# EAGLE board E-bookReader (EAGLE 9.7.0)
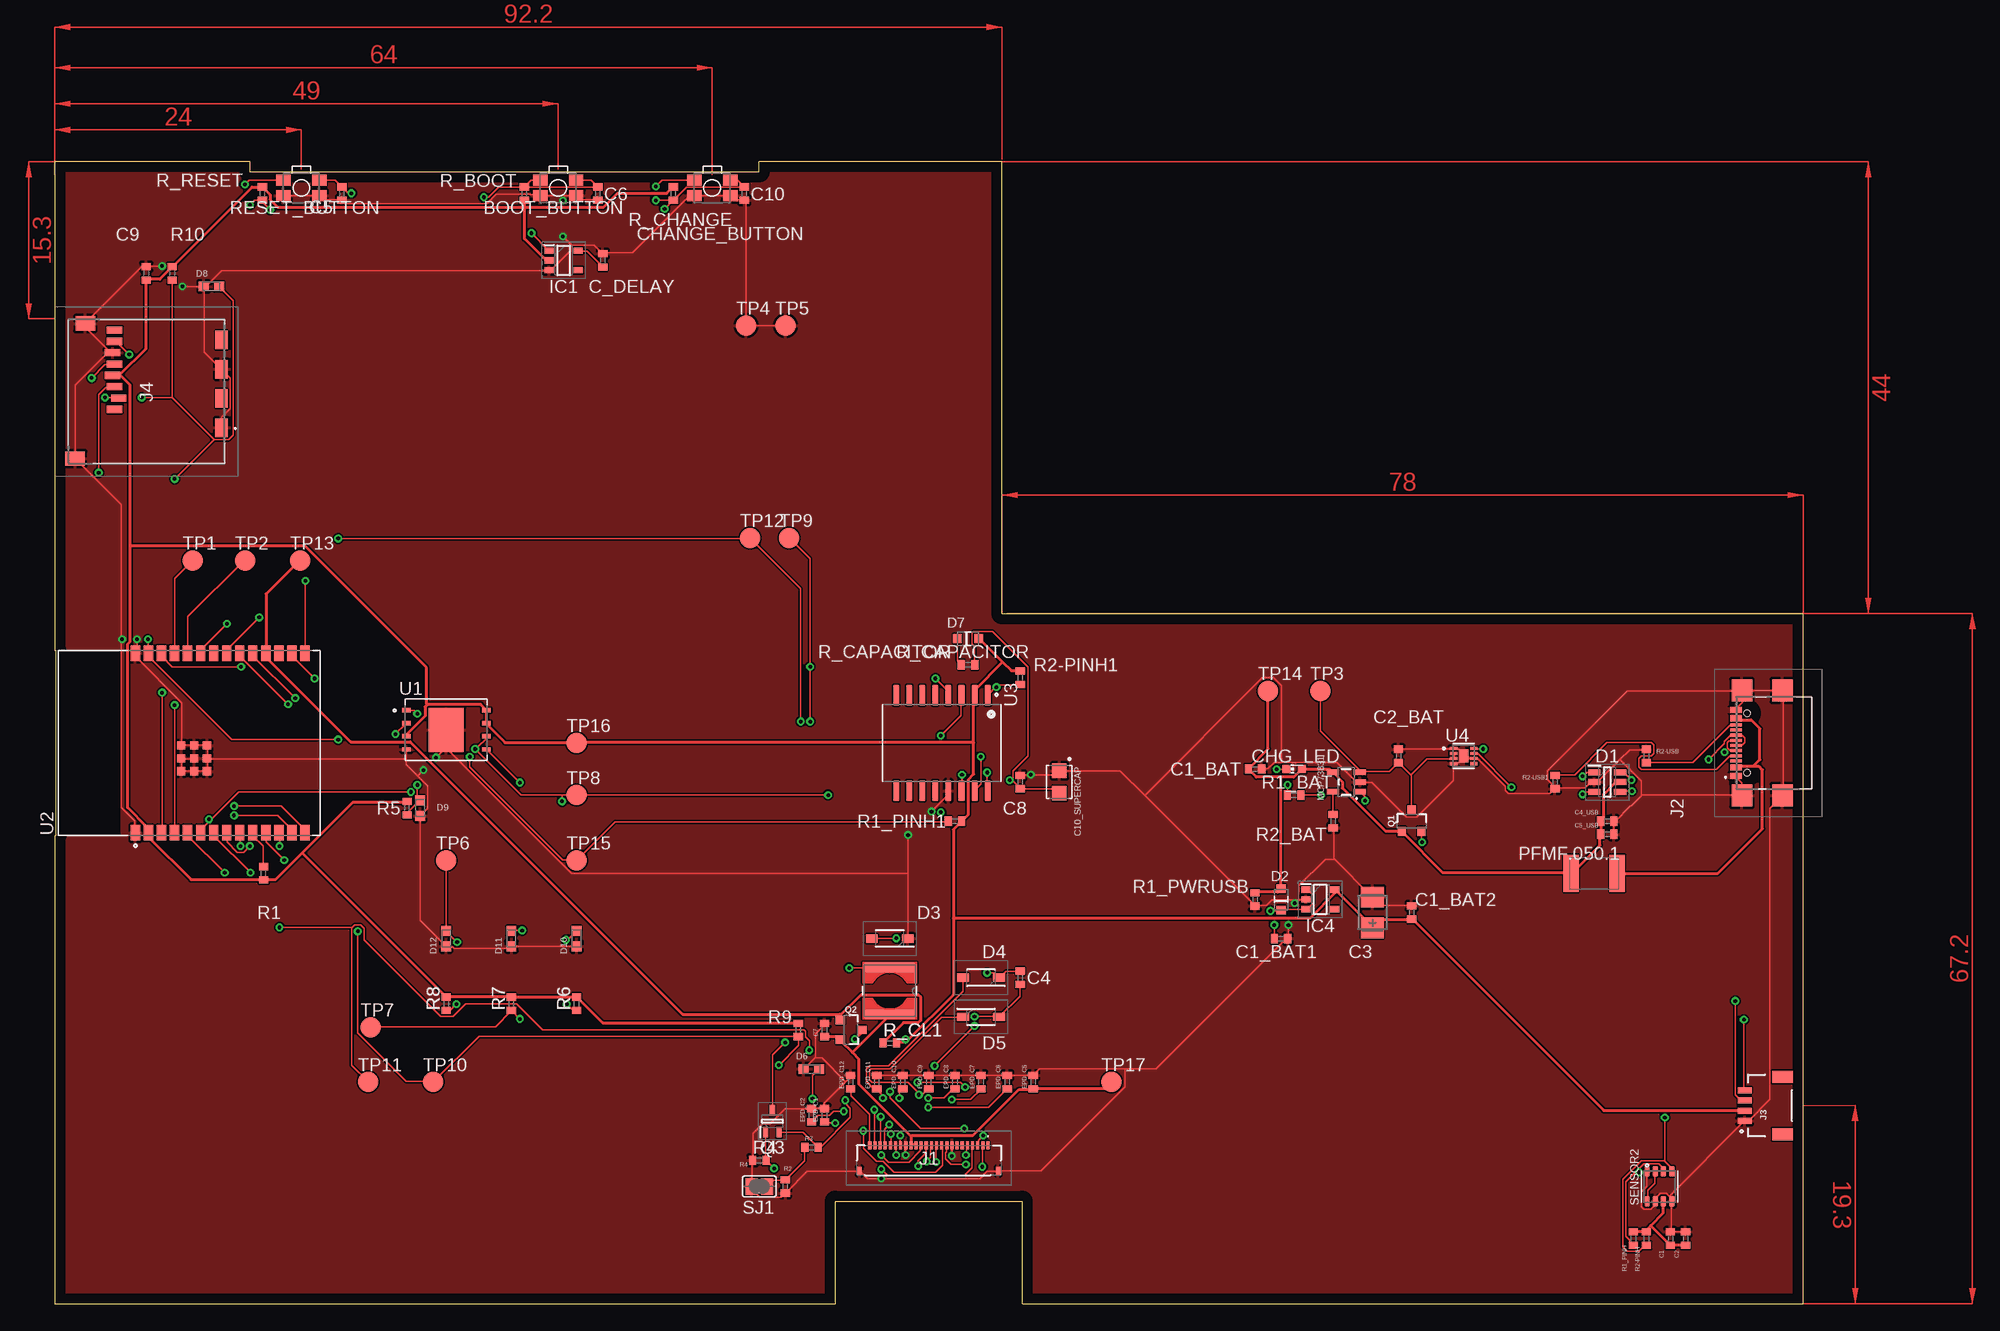
[diagram p1: board, top side]
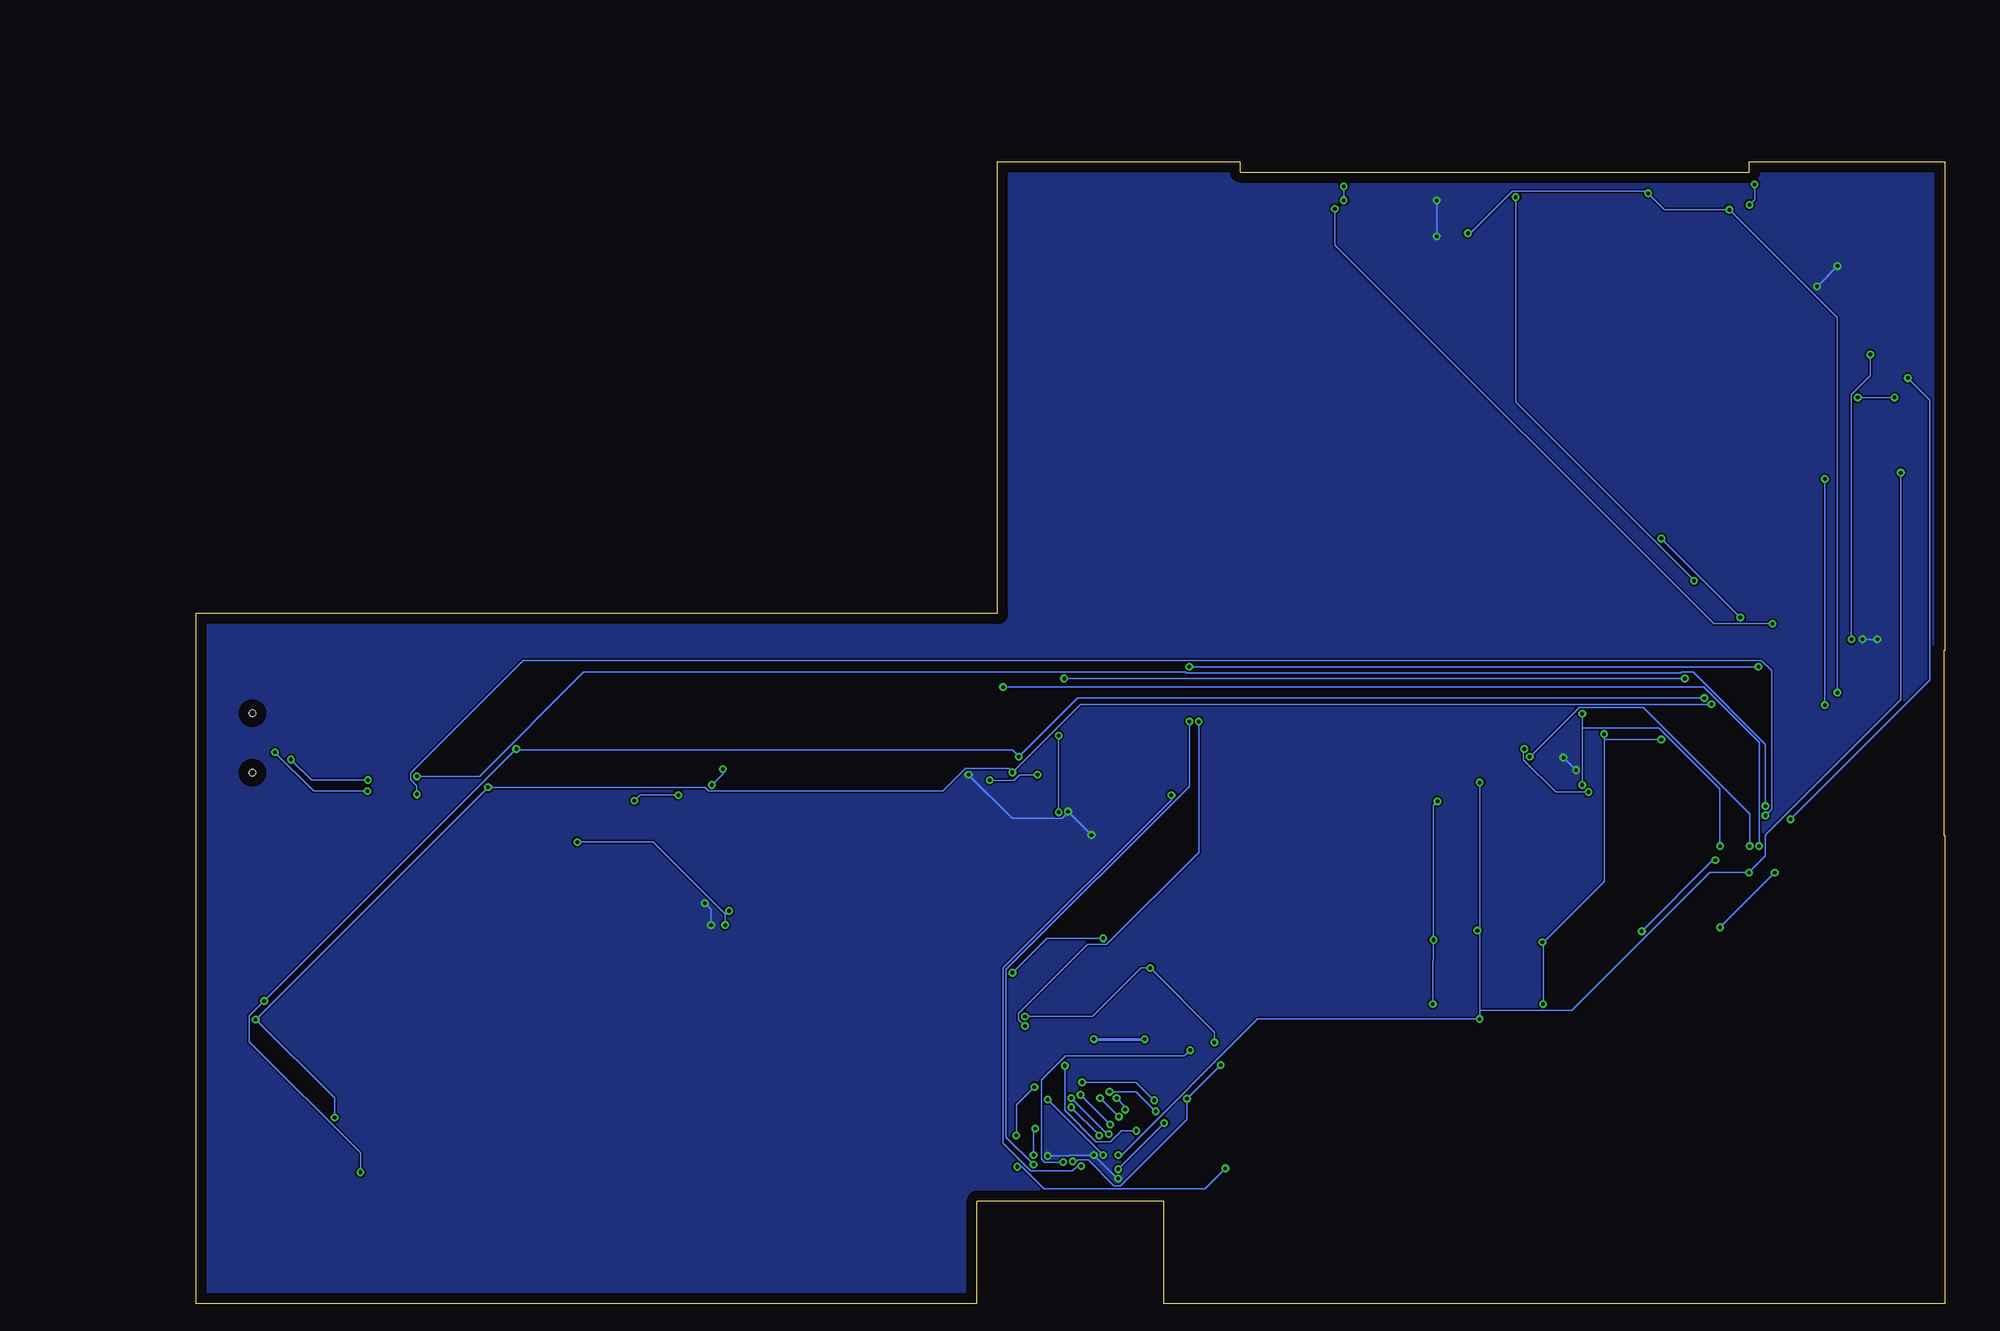
[diagram p2: board, bottom side, seen from below]

Size 170.2 x 111.2 mm. Coordinates in mm from the lower left corner, seen from the top.
Outline: 0,0 76,0 76,10 94.2,10 94.2,0 170.2,0 170.2,67.2 92.2,67.2 92.2,111.2 68.57,111.2 68.57,110.2 19,110.2 19,111.2 0,111.2 0,63.6 0.1,63.6 0.1,45.6 0,45.6 0,0
Copper layers (1*16): Top 0.035mm / dielectric 1.5mm / Bottom 0.035mm
Design rules "Fusion Electronics Design Rules": minimum track width 6mil, minimum drill 0.35mm, track to track 6mil, track to pad 6mil, pad to pad 6mil, via to via 6mil, smd to smd 6mil, copper to edge 40mil, drill to drill 6mil, minimum pad ring 10mil, minimum via ring 8mil, stop-mask expansion 4mil, vias tented up to drill 0mil, thermal gap 10mil
Net classes: 1 power: width 0.3 mm

## Footprints (pad centres in the part's own frame; a part is rotated, then mirrored left to right if it is on the bottom)
MYBUTTON = smd 1.4 x 1.05: 1 1.75,0.75; 2 -1.75,0.75; 3 -1.75,-0.75; 4 1.75,-0.75
EAGLE-LTSPICE_C0402 = smd 0.7 x 0.9: 1 -0.65,0; 2 0.65,0
RCL_CT3528 = smd 2 x 2.2: + -1.5,0; - 1.5,0
CAPCP3225X100N = smd 1.4 x 1.4: 1 -1.1,0; 2 1.1,0
ADAFRUIT_CHIP-LED0603 = smd 0.8 x 0.8: A 0,-0.75; C 0,0.75
SOT95P280X145-6N = smd 1.2 x 0.6: 1 -1.25,0.95; 2 -1.25,0; 3 -1.25,-0.95; 4 1.25,-0.95; 5 1.25,0; 6 1.25,0.95
ESP32_WROVER_AVX---SD0805S020S1R0_AVX_SD0805S020S1R0_0 = smd 0.8 x 0.9: 1 -1.05,0; 2 1.05,0
SOD3716X135N = smd 1.15 x 0.8: 1 -1.75,0; 2 1.75,0
DIOC1608X36N = smd 0.97 x 0.94: 1 -0.75,0; 2 0.75,0
SOT95P280X125-5N = smd 0.9 x 0.6: 1 -1.4,0.95; 2 -1.4,0; 3 -1.4,-0.95; 4 1.4,-0.95; 5 1.4,0.95
SOT95P280X120-5N = smd 0.9 x 0.6: 1 -1.4,0.95; 2 -1.4,0; 3 -1.4,-0.95; 4 1.4,-0.95; 5 1.4,0.95
FH34SRJ24S05SH99 = smd 0.3 x 0.8: 1 5.75,1.45; 2 5.25,1.45; 3 4.75,1.45; 4 4.25,1.45; 5 3.75,1.45; 6 3.25,1.45; 7 2.75,1.45; 8 2.25,1.45; 9 1.75,1.45; 10 1.25,1.45; 11 0.75,1.45; 12 0.25,1.45; 13 -0.25,1.45; 14 -0.75,1.45; 15 -1.25,1.45; 16 -1.75,1.45; 17 -2.25,1.45; 18 -2.75,1.45; 19 -3.25,1.45; 20 -3.75,1.45; 21 -4.25,1.45; 22 -4.75,1.45; 23 -5.25,1.45; 24 -5.75,1.45 | smd 0.4 x 0.8: MP1 6.75,-1.05; MP2 -6.75,-1.05
SAMACSYS_PARTS_USB4110GFA = smd 0.3 x 1.15: A1 -3.35,3.678; A4 -2.55,3.678; A5 -1.25,3.678; A6 -0.25,3.678; A7 0.25,3.678; A8 1.25,3.678; A9 2.55,3.678; A12 3.35,3.678; B1 3.05,3.678; B4 2.25,3.678; B5 1.75,3.678; B6 0.75,3.678; B7 -0.75,3.678; B8 -1.75,3.678; B9 -2.25,3.678; B12 -3.05,3.678 | smd 2.18 x 2: MP1 -5.11,-0.827; MP2 5.11,-0.827; MP3 -5.11,3.103; MP4 5.11,3.103 | hole 0.65: -2.89,2.603; 2.89,2.603
JST04_1MM_RA = smd 0.6 x 1.35: 1 -1.5,0; 2 -0.5,0; 3 0.5,0; 4 1.5,0 | smd 1.2 x 2: NC1 2.8,-3.675; NC2 -2.8,-3.675
112ATAARR03ATTEND = smd 1.8 x 1.2: G1 10.6,10.4; G2 4.9,10.4; S1 7.75,10.4; S2 2.05,10.4 | smd 1.4 x 1.9: G3 13.6,-3.85; G4 0.45,-2.85 | smd 0.7 x 1.5: P1 8.8,0; P2 7.7,0.4; P3 6.6,0; P4 5.5,-0.2; P5 4.4,0; P6 3.3,-0.2; P7 2.2,0; P8 1.1,0
IND_4828-WE-TPC_WRE = smd 0.889 x 4.826: 1 -2.286,0; 2 2.286,0
ESP32_WROVER_SPARKFUN-IC-POWER_SOT23-5 = smd 0.55 x 1.2: 1 -0.95,-1.3; 2 0,-1.3; 3 0.95,-1.3; 4 0.95,1.3; 5 -0.95,1.3
ESP32C6_VARISTOR_CT/CN1812 = smd 1.5 x 3.6: 1 -2.25,0; 2 2.25,0
ESP32_WROVER_SPARKFUN-DISCRETESEMI_SOT23-3 = smd 0.8 x 0.9: 1 -0.95,-1; 2 0.95,-1; 3 0,1.1
SOT65P210X110-3N = smd 1.05 x 0.5: 1 -1.05,0.65; 2 -1.05,-0.65; 3 1.05,0
ESP32_WROVER_EAGLE-LTSPICE_R0402 = smd 0.7 x 0.9: 1 -0.65,0; 2 0.65,0
ESP32_WROVER_BME680_PSON80P300X300X100-8N = smd 1.016 x 0.5: 1 1.458,1.2; 2 1.458,0.4; 3 1.458,-0.4; 4 1.458,-1.2; 5 -1.458,-1.22; 6 -1.458,-0.4; 7 -1.458,0.4; 8 -1.458,1.2
SJ = smd 1.168 x 1.6: 1 -0.762,0; 2 0.762,0
TP20R = smd 2 x 2: TP 0,0
SON127P600X800X80-9N = smd 0.94 x 0.44: 1 -3.895,1.905; 2 -3.895,0.635; 3 -3.895,-0.635; 4 -3.895,-1.905; 5 3.895,-1.905; 6 3.895,-0.635; 7 3.895,0.635; 8 3.895,1.905 | smd 3.4 x 4.3: 9 0,0
XCVR_ESP32-C6-WROOM-1-N8 = smd 1.5 x 0.9: 1 -8.75,5.26; 2 -8.75,3.99; 3 -8.75,2.72; 4 -8.75,1.45; 5 -8.75,0.18; 6 -8.75,-1.09; 7 -8.75,-2.36; 8 -8.75,-3.63; 9 -8.75,-4.9; 10 -8.75,-6.17; 11 -8.75,-7.44; 12 -8.75,-8.71; 13 -8.75,-9.98; 14 -8.75,-11.25; 15 8.75,-11.25; 16 8.75,-9.98; 17 8.75,-8.71; 18 8.75,-7.44; 19 8.75,-6.17; 20 8.75,-4.9; 21 8.75,-3.63; 22 8.75,-2.36; 23 8.75,-1.09; 24 8.75,0.18; 25 8.75,1.45; 26 8.75,2.72; 27 8.75,3.99; 28 8.75,5.26 | smd 0.8 x 0.8: 29_1 -2.755,0.79; 29_2 -1.505,0.79; 29_3 -0.255,0.79; 29_4 -2.755,-0.46; 29_5 -1.505,-0.46; 29_6 -0.255,-0.46; 29_7 -2.755,-1.71; 29_8 -1.505,-1.71; 29_9 -0.255,-1.71
SOIC127P1032X265-16N = smd 2.05 x 0.59: 1 -4.655,4.445; 2 -4.655,3.175; 3 -4.655,1.905; 4 -4.655,0.635; 5 -4.655,-0.635; 6 -4.655,-1.905; 7 -4.655,-3.175; 8 -4.655,-4.445; 9 4.655,-4.445; 10 4.655,-3.175; 11 4.655,-1.905; 12 4.655,-0.635; 13 4.655,0.635; 14 4.655,1.905; 15 4.655,3.175; 16 4.655,4.445
SON50P200X200X80-9N = smd 0.76 x 0.27: 1 -0.985,0.75; 2 -0.985,0.25; 3 -0.985,-0.25; 4 -0.985,-0.75; 5 0.985,-0.75; 6 0.985,-0.25; 7 0.985,0.25; 8 0.985,0.75 | smd 0.9 x 1.3: 9 0,0

## Placement (x,y rotation side)
BOOT_BUTTON  BUTTON_CUSYOMV1  [MYBUTTON]  49,108.65 180 top
C1  100nF  [EAGLE-LTSPICE_C0402]  157.28,6.35 90 top
C1_BAT  4.7uF  [EAGLE-LTSPICE_C0402]  116.84,52.07 0 top
C1_BAT1  4.7uF  [EAGLE-LTSPICE_C0402]  119.38,35.56 0 top
C1_BAT2  4.7uF  [EAGLE-LTSPICE_C0402]  132.08,38.1 90 top
C2  100nF  [EAGLE-LTSPICE_C0402]  158.75,6.35 90 top
C2_BAT  4.7uF  [EAGLE-LTSPICE_C0402]  130.81,53.34 90 top
C3  100uF TANT  [RCL_CT3528]  128.27,38.1 90 top
C4  4.7uF/25V  [EAGLE-LTSPICE_C0402]  93.98,31.75 270 top
C4_USB  100nF  [EAGLE-LTSPICE_C0402]  151.13,46.99 0 top
C5  1uF  [EAGLE-LTSPICE_C0402]  27.94,108.1 270 top
C5_USB  4.7 uF  [EAGLE-LTSPICE_C0402]  151.13,45.72 0 top
C6  100nF  [EAGLE-LTSPICE_C0402]  52.85,108.1 270 top
C7  10uF  [EAGLE-LTSPICE_C0402]  74.93,26.67 90 top
C8  100nF  [EAGLE-LTSPICE_C0402]  93.98,50.8 90 top
C9  100nF  [EAGLE-LTSPICE_C0402]  8.89,100.33 90 top
C10  100nF  [EAGLE-LTSPICE_C0402]  67.12,108.1 270 top
C10_SUPERCAP  CPH3225A  [CAPCP3225X100N]  97.79,50.8 270 top
C_DELAY  100nF  [EAGLE-LTSPICE_C0402]  53.34,101.6 90 top
CHANGE_BUTTON  BUTTON_CUSYOMV1  [MYBUTTON]  64,108.65 180 top
CHG_LED  [ADAFRUIT_CHIP-LED0603]  120.65,52.07 90 top
D1  USBLC6-2SC6Y  [SOT95P280X145-6N]  151.13,50.8 0 top
D2  ESP32_WROVER_AVX---SD0805S020S1R0_AVX_SD0805S020S1R0_0_0AVX_SD0805S020S1R0_0_0  [ESP32_WROVER_AVX---SD0805S020S1R0_AVX_SD0805S020S1R0_0]  119.38,39.37 90 top
D3  MBR0530  [SOD3716X135N]  81.28,35.56 180 top
D4  MBR0530  [SOD3716X135N]  90.17,31.75 180 top
D5  MBR0530  [SOD3716X135N]  90.17,27.94 0 top
D6  PGB1010603MR  [DIOC1608X36N]  73.66,22.86 0 top
D7  ESP32_WROVER_AVX---SD0805S020S1R0_AVX_SD0805S020S1R0_0_0AVX_SD0805S020S1R0_0_0  [ESP32_WROVER_AVX---SD0805S020S1R0_AVX_SD0805S020S1R0_0]  88.9,64.77 0 top
D8  PGB1010603MR  [DIOC1608X36N]  15.24,99.06 0 top
D9  PGB1010603MR  [DIOC1608X36N]  35.56,48.26 90 top
D10  PGB1010603MR  [DIOC1608X36N]  50.8,35.56 90 top
D11  PGB1010603MR  [DIOC1608X36N]  44.45,35.56 90 top
D12  PGB1010603MR  [DIOC1608X36N]  38.1,35.56 90 top
EPD_C1  1uF/50V  [EAGLE-LTSPICE_C0402]  74.93,18.37 90 top
EPD_C2  1uF/50V  [EAGLE-LTSPICE_C0402]  73.66,18.37 90 top
EPD_C5  0.1uF/50V  [EAGLE-LTSPICE_C0402]  95.25,21.59 90 top
EPD_C6  1uF/50V  [EAGLE-LTSPICE_C0402]  92.71,21.59 90 top
EPD_C7  1uF/50V  [EAGLE-LTSPICE_C0402]  90.17,21.59 90 top
EPD_C8  1uF/50V  [EAGLE-LTSPICE_C0402]  87.63,21.59 90 top
EPD_C9  1uF/50V  [EAGLE-LTSPICE_C0402]  85.09,21.59 90 top
EPD_C10  1uF/50V  [EAGLE-LTSPICE_C0402]  82.55,21.59 90 top
EPD_C11  1uF/50V  [EAGLE-LTSPICE_C0402]  80.01,21.59 90 top
EPD_C12  1uF/50V  [EAGLE-LTSPICE_C0402]  77.47,21.59 90 top
IC1  BD5229G-TR  [SOT95P280X125-5N]  49.53,101.6 0 top
IC4  XC6220A331MR-G  [SOT95P280X120-5N]  123.19,39.37 0 top
J1  FH34SRJ-24S-0.5SH_99_  [FH34SRJ24S05SH99]  85.09,13.97 0 top
J2  SAMACSYS_PARTS_USB4110-GF-A  [SAMACSYS_PARTS_USB4110GFA]  167.36,54.61 90 top
J3  QWIIC_RIGHT_ANGLE  [JST04_1MM_RA]  164.51,19.3 90 top
J4  112A-TAAR-R03_ATTEND  [112ATAARR03ATTEND]  5.82,95.9 270 top
L1  744043680IND_4828-WE-TPC_WRE  [IND_4828-WE-TPC_WRE]  81.28,30.48 270 top
MCP73831  ESP32_WROVER_SPARKFUN-IC-POWER_MCP73831  [ESP32_WROVER_SPARKFUN-IC-POWER_SOT23-5]  125.73,50.8 90 top
PFMF.050.1  ESP32C6_VARISTORCN1812  [ESP32C6_VARISTOR_CT/CN1812]  149.86,41.91 180 top
Q1  20V/4.2A/52mΩ/1.4W  [ESP32_WROVER_SPARKFUN-DISCRETESEMI_SOT23-3]  132.08,46.99 0 top
Q2  20V/4.2A/52mΩ/1.4W  [ESP32_WROVER_SPARKFUN-DISCRETESEMI_SOT23-3]  77.47,26.67 270 top
Q3  SI1308EDL-T1-GE3  [SOT65P210X110-3N]  69.85,17.78 90 top
R1  10k  [ESP32_WROVER_EAGLE-LTSPICE_R0402]  20.32,41.91 270 top
R1_BAT  200  [ESP32_WROVER_EAGLE-LTSPICE_R0402]  120.65,49.53 0 top
R1_PINH  [ESP32_WROVER_EAGLE-LTSPICE_R0402]  153.67,6.35 90 top
R1_PINH1  10k  [ESP32_WROVER_EAGLE-LTSPICE_R0402]  87.63,46.99 0 top
R1_PWRUSB  100k  [ESP32_WROVER_EAGLE-LTSPICE_R0402]  116.84,39.37 90 top
R2  2.2  [ESP32_WROVER_EAGLE-LTSPICE_R0402]  71.12,11.43 90 top
R2-PINH  [ESP32_WROVER_EAGLE-LTSPICE_R0402]  154.94,6.35 90 top
R2-PINH1  10k  [ESP32_WROVER_EAGLE-LTSPICE_R0402]  93.98,60.96 90 top
R2-USB  5k1  [ESP32_WROVER_EAGLE-LTSPICE_R0402]  154.94,53.34 90 top
R2-USB1  5k1  [ESP32_WROVER_EAGLE-LTSPICE_R0402]  146.05,50.8 90 top
R2_BAT  2k  [ESP32_WROVER_EAGLE-LTSPICE_R0402]  124.46,46.99 90 top
R3  0.47  [ESP32_WROVER_EAGLE-LTSPICE_R0402]  73.66,15.24 0 top
R4  10K  [ESP32_WROVER_EAGLE-LTSPICE_R0402]  68.58,13.97 0 top
R5  10K  [ESP32_WROVER_EAGLE-LTSPICE_R0402]  34.29,48.26 90 top
R6  10K  [ESP32_WROVER_EAGLE-LTSPICE_R0402]  50.8,29.21 90 top
R7  10K  [ESP32_WROVER_EAGLE-LTSPICE_R0402]  44.45,29.21 90 top
R8  10K  [ESP32_WROVER_EAGLE-LTSPICE_R0402]  38.1,29.21 90 top
R9  10K  [ESP32_WROVER_EAGLE-LTSPICE_R0402]  72.39,26.67 90 top
R10  10K  [ESP32_WROVER_EAGLE-LTSPICE_R0402]  11.43,100.33 90 top
R_BOOT  10K  [ESP32_WROVER_EAGLE-LTSPICE_R0402]  45.72,108.1 270 top
R_CAPACITOR  15  [ESP32_WROVER_EAGLE-LTSPICE_R0402]  88.9,62.23 0 top
R_CHANGE  10K  [ESP32_WROVER_EAGLE-LTSPICE_R0402]  60.2,108.1 90 top
R_CL1  10K  [ESP32_WROVER_EAGLE-LTSPICE_R0402]  81.28,25.4 0 top
R_RESET  10K  [ESP32_WROVER_EAGLE-LTSPICE_R0402]  20.2,108.1 90 top
RESET_BUTTON  BUTTON_CUSYOMV1  [MYBUTTON]  24,108.65 180 top
SENSOR2  ESP32_WROVER_BME680_BME680  [ESP32_WROVER_BME680_PSON80P300X300X100-8N]  156.21,11.43 90 top
SJ1  [SJ]  68.58,11.43 0 top
TP1  TPTP20R  [TP20R]  13.43,72.39 0 top
TP2  TPTP20R  [TP20R]  18.51,72.39 0 top
TP3  TPTP20R  [TP20R]  123.19,59.69 0 top
TP4  TPTP20R  [TP20R]  67.31,95.25 0 top
TP5  TPTP20R  [TP20R]  71.12,95.25 0 top
TP6  TPTP20R  [TP20R]  38.1,43.18 0 top
TP7  TPTP20R  [TP20R]  30.73,26.92 0 top
TP8  TPTP20R  [TP20R]  50.8,49.53 0 top
TP9  TPTP20R  [TP20R]  71.5,74.58 0 top
TP10  TPTP20R  [TP20R]  36.83,21.59 0 top
TP11  TPTP20R  [TP20R]  30.48,21.59 0 top
TP12  TPTP20R  [TP20R]  67.69,74.58 0 top
TP13  TPTP20R  [TP20R]  23.88,72.39 0 top
TP14  TPTP20R  [TP20R]  118.11,59.69 0 top
TP15  TPTP20R  [TP20R]  50.8,43.18 0 top
TP16  TPTP20R  [TP20R]  50.8,54.61 0 top
TP17  TPTP20R  [TP20R]  102.87,21.59 0 top
U1  W25Q512JVEIQ  [SON127P600X800X80-9N]  38.1,55.88 0 top
U2  ESP32-C6-WROOM-1-N8  [XCVR_ESP32-C6-WROOM-1-N8]  13.1,54.61 90 top
U3  DS3231SN#  [SOIC127P1032X265-16N]  86.36,54.61 270 top
U4  MAX17048G+T10  [SON50P200X200X80-9N]  137.16,53.34 0 top

## Tracks (layer width: path | path; a pad name or v marks a point on that pad's centre or on a via)
3V3  (via drill 0.35)
  Top 0.3: 45.72,106.76 45.72,103.71 47.78,101.65 48.08,101.65 IC1.2 | 45.72,106.76 R_BOOT.2 | 45.72,106.76 53.42,106.76 54.78,108.12 59.58,108.12 R_CHANGE.2 | 6.33,90.45 5.64,90.45 J4.P4 | 6.33,90.45 8.84,92.96 8.84,99.59 C9.1 8.91,99.75 10.21,99.75 11.43,100.97 R10.2 11.51,101.04 19.2,108.74 20.19,108.74 R_RESET.2 20.27,108.66 20.95,107.97 20.95,107.52 21.72,106.76 45.72,106.76 | 24.08,43.89 21.49,41.3 20.42,41.3 R1.2 20.27,41.3 13.26,41.3 9.14,45.41 9.14,45.8 U2.2 8.99,45.95 8.99,46.41 7.09,48.31 7.09,64.24 7.32,64.47 7.32,73.76 | 24.08,43.89 29.03,48.84 34.29,48.84 R5.2 | R9.2 72.39,27.36 53.34,27.36 50.9,29.79 R6.2 50.75,29.87 44.58,29.87 R7.2 44.42,29.87 R8.2 38.02,29.95 24.08,43.89 | 6.33,90.45 7.32,89.46 7.32,73.76 | J3.2 164.44,18.82 150.8,18.82 132.21,37.41 C1_BAT2.1 132.06,37.41 129.08,37.41 128.4,36.73 C3.+ 128.32,36.65 124.66,40.31 IC4.5 124.74,40.08 122.22,37.57 87.48,37.57 | 36.27,58.37 36.04,58.14 36.04,57.23 34.21,55.4 34.21,55.24 U1.3 | 36.27,58.37 41.45,58.37 41.99,57.84 U1.8 41.99,57.68 41.99,56.54 U1.7 42.06,56.39 43.81,54.63 50.75,54.63 TP16.TP 50.9,54.63 89.46,54.63 | 92.28,62.48 89.99,64.77 D7.2 | 92.28,62.48 93.12,61.65 93.95,61.65 R2-PINH1.2 | 92.28,62.48 89.53,59.74 U3.2 89.46,59.13 89.46,54.63 | 82.98,25.6 87.48,30.1 87.48,37.57 | 82.98,25.6 82.83,25.45 81.99,25.45 R_CL1.2 | 87.48,37.57 87.48,46.18 88.24,46.94 R1_PINH1.2 88.39,47.09 88.92,47.62 88.92,51.05 89.46,51.59 89.46,54.63 | 7.32,73.76 24.38,73.76 36.2,61.95 36.2,58.45 36.27,58.37 | v77.88,25.76 78.56,26.44 Q2.3 | v82.83,25.76 82.98,25.6
  Bottom 0.3: v82.83,25.76 v77.88,25.76
12C_PW
  Top 0.3: C2.1 158.72,5.71 157.35,5.71 C1.1 157.2,5.79 155.37,7.62 | R1_PINH.2 153.69,7.01 154.91,7.01 R2-PINH.2 154.91,7.16 155.37,7.62 | 155.37,7.62 156.59,8.84 156.59,9.91 SENSOR2.6
32KHZ  (via drill 0.35)
  Top 0.152: 91.63,60.08 90.83,59.28 U3.1 | 91.63,60.08 91.82,60.27 93.95,60.27 R2-PINH1.1 | v18.06,44.58 18.06,45.8 U2.9 | v91.67,60.05 91.63,60.08
  Bottom 0.152: v18.06,44.58 18.06,54.63 23.47,60.05 v91.67,60.05
DN  (via drill 0.35)
  Top 0.152: 162.88,54.06 162.84,54.1 162.84,54.63 162.99,54.79 163.68,54.79 J2.A7 | 162.88,54.06 163.07,53.87 163.68,53.87 J2.B7 | v153.54,49.91 152.4,49.91 D1.4 | 162.88,54.06 162.56,53.74 v162.56,53.7
  Bottom 0.152: v162.56,53.7 158.77,49.91 v153.54,49.91
DP  (via drill 0.35)
  Top 0.152: J2.A6 163.75,54.41 164.29,54.41 164.52,54.63 164.52,55.09 164.29,55.32 163.75,55.32 J2.B6 163.13,55.36 162.53,54.76 162.53,54.53 v161,53 | D1.6 152.4,51.74 152.77,51.74 v153.51,51
  Bottom 0.152: v161,53 159,51 v153.51,51 v153.5,51
EPD_3V3
  Top 0.3: TP17.TP 102.87,21.57 102.26,20.95 95.25,20.95 EPD_C5.1 95.17,20.88 93.88,20.88 89.38,16.38 83.44,16.38 83.36,16.31 | J1.15 83.82,15.47 83.36,15.47 J1.16 83.36,15.62 83.36,16.31 | C7.1 74.98,25.98 76.2,25.98 76.43,25.76 Q2.2 76.5,25.6 77.65,24.46 | 83.36,16.31 78.26,21.41 78.26,23.85 77.65,24.46 | 77.65,24.46 81.23,28.04 81.23,28.19 L1.2
EPD_3V3_C
  Top 0.3: 76.5,28.12 78.49,30.1 84.05,30.1 84.28,29.87 84.28,27.58 84.05,27.36 82.6,27.36 80.7,25.45 R_CL1.1 | 76.5,28.12 76.5,27.66 Q2.1 | TP13.TP 23.85,72.39 20.57,69.11 20.57,63.4 U2.18 20.57,63.25 20.57,62.94 28.8,54.71 34.59,54.71 61.11,28.19 76.43,28.19 76.5,28.12
EPD_BUSY  (via drill 0.35)
  Top 0.152: v88.7,13.56 87.25,13.56 86.72,14.1 86.72,14.71 86.79,14.78 86.79,15.39 J1.9 | v73.53,56.69 v73.53,62.03 73.53,72.54 71.55,74.52 TP9.TP | v18.14,62.03 11.43,62.03 10.44,63.02 10.44,63.32 U2.26
  Bottom 0.152: v88.7,13.56 91.36,16.23 91.36,32.54 73.53,50.37 v73.53,56.69 | v73.53,62.03 v18.14,62.03
EPD_CS  (via drill 0.35)
  Top 0.152: v84.89,13.87 85.27,14.25 85.27,15.39 J1.12 | v73.76,19.96 73.76,22.25 74.37,22.86 D6.2 | v70.48,23.24 72.39,25.15 R9.1 72.39,26.06 41.3,26.06 TP10.TP 36.8,21.64 34.21,21.64 29.49,26.36 v29.49,36.27 | v22.33,43.2 20.57,44.96 20.57,45.8 U2.11
  Bottom 0.152: v84.89,13.87 84.51,13.87 84.35,14.02 83.36,14.02 80.85,11.51 80.24,11.51 73.76,17.98 v73.76,19.96 v70.48,23.24 | v22.33,43.2 22.55,43.2 v29.49,36.27
EPD_DC  (via drill 0.35)
  Top 0.152: v85.8,13.79 85.8,15.39 J1.11 | v73.46,24.69 73.46,25.6 73.08,25.98 73.08,26.52 72.92,26.67 47.47,26.67 44.96,29.18 40.01,29.18 38.79,27.96 37.57,27.96 30.1,35.43 30.1,36.58 29.79,36.88 29.18,36.88 28.92,36.61 | 28.92,36.61 28.88,36.58 28.88,23.24 30.48,21.64 TP11.TP | v16.54,41.99 12.95,45.57 12.95,45.8 U2.5 | v21.87,36.65 28.88,36.65 28.92,36.61
  Bottom 0.152: v85.8,13.79 87.63,13.79 87.94,14.1 87.94,21.79 85.57,24.16 73.99,24.16 v73.46,24.69 | v21.87,36.65 v16.54,41.99
EPD_RST  (via drill 0.35)
  Top 0.152: v78.72,16.84 78.72,15.16 80.01,13.87 80.62,13.87 81.69,12.8 85.72,12.8 86.41,13.49 86.41,15.39 J1.10 | v89.53,27.05 v85.65,23.16 | v72.62,56.69 72.62,69.65 67.74,74.52 TP12.TP 67.67,74.52 v27.58,74.52 | v19.89,66.83 16.76,63.7 16.76,63.4 U2.21
  Bottom 0.152: v78.72,16.84 80.16,16.84 81.23,15.77 82.6,15.77 85.65,18.82 v85.65,23.16 | v89.53,27.05 90.14,27.66 90.14,28.27 83.44,34.98 81.61,34.98 72.62,43.97 v72.62,56.69 | v27.58,74.52 v19.89,66.83
FLASH_CS  (via drill 0.35)
  Top 0.152: R5.1 34.29,47.78 35.51,49 D9.2 35.51,49.07 35.28,49.3 v35.28,50.52 | v35.28,57.45 34.98,57.76 34.21,57.76 U1.1 | v21.87,44.58 21.87,45.8 U2.12
  Bottom 0.152: v35.28,50.52 35.28,56.08 | 35.28,56.08 v35.28,57.45 | v21.87,44.58 21.87,50.14 27.81,56.08 35.28,56.08
GDR  (via drill 0.35)
  Top 0.152: v90.3,13.34 90.3,15.39 J1.2 | v70.03,13.18 69.27,13.95 R4.2 69.19,14.02 69.19,16.69 Q3.1
  Bottom 0.152: v90.3,13.34 89.84,13.34 87.71,11.2 72.01,11.2 v70.03,13.18
GND  (via drill 0.35)
  Top 0.152: C6.2 52.81,107.52 51.21,107.52 50.83,107.9 BOOT_BUTTON.2 49.45,107.9 | 49.45,107.9 47.32,107.9 BOOT_BUTTON.1 47.24,107.97 46.33,107.97 46.25,108.05 42.98,108.05 42.06,107.14 28.27,107.14 27.96,107.44 C5.2 27.89,107.52 26.14,107.52 RESET_BUTTON.2 25.68,107.9 RESET_BUTTON.1 | 14.55,99.06 14.55,92.66 16.15,91.06 J4.G2 16.23,90.98 17.07,90.14 17.07,87.17 16.23,86.33 16.23,85.34 J4.G1 | TP5.TP TP4.TP 67.28,95.25 67.28,107.29 67.13,107.44 C10.2 67.06,107.52 66.14,107.52 CHANGE_BUTTON.2 65.68,107.9 CHANGE_BUTTON.1 62.18,107.9 61.8,107.9 56.24,102.34 53.34,102.34 C_DELAY.2 52.5,103.1 50.37,103.1 50.33,103.06 | 50.33,103.06 50.22,102.95 50.22,102.56 48.31,100.66 48.16,100.66 IC1.3 48.08,100.58 16.23,100.58 14.71,99.06 14.55,99.06 | 14.55,99.06 D8.1 v12.42,99.06 | v49.45,107.44 49.45,107.9 | 50.33,103.06 v49.45,103.94 | 6.48,64.69 6.48,77.8 1.98,82.3 J4.G3 1.98,82.37 1.98,89.46 5.26,92.73 J4.P6 5.56,92.66 5.41,92.66 2.97,95.1 2.97,95.4 J4.G4 2.97,95.48 8.46,100.97 8.84,100.97 C9.2 8.91,101.04 v10.44,101.04 | 6.48,64.69 6.48,48.31 7.77,47.02 7.77,45.87 U2.1 | U2.29_8 14.86,53.03 14.86,51.89 U2.29_7 14.78,51.89 13.56,51.89 U2.29_4 13.49,51.89 12.42,51.89 U2.29_1 12.34,51.89 12.34,53.03 U2.29_2 12.42,53.03 13.49,53.03 U2.29_5 | U2.29_8 14.86,53.11 14.86,54.33 U2.29_9 14.78,54.41 13.56,54.41 U2.29_6 13.49,54.41 12.34,54.41 U2.29_3 12.34,54.48 12.34,58.52 7.85,63.02 7.85,63.32 U2.28 7.85,63.4 8,63.55 v8,64.69 | 34.21,53.03 34.21,52.5 35.32,51.4 | 34.21,53.03 34.21,53.95 U1.4 | 35.32,51.4 36.27,50.44 36.27,48.23 35.59,47.55 D9.1 35.59,47.47 35.59,37.34 38.1,34.82 D12.1 38.1,34.75 38.71,34.75 38.86,34.59 44.27,34.59 44.42,34.75 D11.1 44.5,34.82 50.75,34.82 D10.1
  Top 0.152: v37.11,53.19 38.1,54.18 U1.9 38.1,54.1 50.29,41.91 83.06,41.91 | 35.32,51.4 v35.89,51.97 | 34.21,53.03 14.94,53.03 U2.29_8 | v6.55,64.69 6.48,64.69 | 74.03,23.96 72.92,22.86 D6.1 | 74.03,23.96 74.07,24 74.07,26.29 74.91,27.13 74.91,27.28 C7.2 | 77,21.6 74.91,19.51 74.91,19.13 EPD_C1.2 74.91,19.05 73.69,19.05 EPD_C2.2 73.61,18.97 71.09,18.97 69.65,17.53 68.89,17.53 67.97,16.61 67.97,14.02 R4.1 67.89,13.95 67.89,11.51 SJ1.1 67.89,11.43 67.89,11.12 68.66,10.36 70.71,10.36 71.09,10.74 R2.1 71.17,10.82 73.23,12.88 78.33,12.88 J1.MP2 78.41,12.88 79.1,12.19 v80.47,12.19 90.07,12.19 90.75,12.88 91.82,12.88 J1.MP1 91.9,12.95 96.01,12.95 104.17,21.11 104.17,22.86 | 77,21.6 77.42,22.02 77.42,22.17 EPD_C12.2 | 77,21.6 74.68,23.93 74.07,23.93 74.03,23.96 | v82.83,14.48 82.83,15.39 J1.17 | v87.33,14.4 87.33,15.39 J1.8 | EPD_C11.2 82.53,22.25 EPD_C10.2 82.6,22.25 85.04,22.25 EPD_C9.2 85.11,22.25 EPD_C8.2 | EPD_C5.2 92.73,22.25 EPD_C6.2 92.66,22.25 90.22,22.25 EPD_C7.2 90.14,22.25 EPD_C8.2 | 104.17,22.86 95.86,22.86 EPD_C5.2 | 104.17,22.86 107.21,22.86 119.86,35.51 120.02,35.51 C1_BAT1.2 120.09,35.59 v120.09,36.88 | EPD_C5.2 | EPD_C8.2 | v83.06,45.64 83.06,41.91 | 83.06,41.91 83.06,35.59 D3.1 | v85.34,47.93 86.94,49.53 86.94,49.91 U3.13 | 124.55,43.32 128.25,39.62 C3.- 128.32,39.55 129.08,38.79 132.06,38.79 C1_BAT2.2 | 124.55,43.32 124.51,43.36 124.51,46.33 R2_BAT.1 | C8.2 94.03,51.51 v95.02,51.51 97.38,51.51 97.77,51.89 C10_SUPERCAP.1 97.84,51.89 103.71,51.89 106.11,49.49 | 121.08,39.32 121.77,39.32 IC4.2 | 121.08,39.32 120.7,39.32 | 120.7,39.32 118.49,39.32 117.96,38.79 116.89,38.79 R1_PWRUSB.1 116.81,38.79 106.11,49.49
  Top 0.152: 121.08,39.32 121.08,40.69 123.67,43.28 124.51,43.28 124.55,43.32 | C2.2 158.72,7.01 157.35,7.01 C1.2 157.35,7.09 157.35,9.98 SENSOR2.5 157.43,9.98 157.43,10.21 157.16,10.48 | 157.16,10.48 156.9,10.74 156.29,10.74 155.83,10.29 155.83,9.98 SENSOR2.7 155.75,9.91 155.75,9.6 155.37,9.22 154.69,9.22 154.46,9.45 154.46,10.9 154.99,11.43 154.99,12.88 SENSOR2.1 | 157.16,10.48 164.44,17.75 J3.1 164.52,17.83 164.9,17.83 166.95,19.89 166.95,48.23 168.17,49.45 J2.MP1 168.25,49.53 168.25,59.66 J2.MP2 168.17,59.74 164.29,59.74 | 164.29,59.74 J2.MP4 164.21,59.66 153.09,59.66 145.31,51.89 145.31,51.05 146.07,50.29 R2-USB1.1 | 119.41,52.73 124.82,52.73 126.72,50.83 127.03,50.83 MCP73831.2 127.1,50.75 128.25,50.75 131.6,47.4 132.59,47.4 136.17,50.98 136.17,52.58 U4.4 136.25,52.65 136.63,52.65 137.16,53.19 U4.9 | 119.41,52.73 118.72,52.73 118.11,52.12 117.5,52.12 C1_BAT.2 | U4.9 137.16,53.49 136.63,54.03 136.25,54.03 U4.1 136.17,54.03 130.84,54.03 C2_BAT.2 | U4.9 137.16,53.11 138.07,53.11 U4.6 138.15,53.03 138.53,53.03 141.2,50.37 141.2,49.99 141.5,49.68 145.54,49.68 146,50.14 R2-USB1.1 | C5_USB.2 151.79,46.94 C4_USB.2 151.87,46.94 153.39,48.46 153.47,48.46 154.46,49.45 154.46,49.53 | R2-USB1.1 146.07,50.22 148.97,50.22 149.5,50.75 149.81,50.75 D1.2 149.88,50.83 150.19,50.83 152.36,53 | 152.36,53 153.31,53.95 154.91,53.95 R2-USB.2 | 154.46,49.53 164.21,49.53 | 164.21,49.53 J2.MP3 | 106.11,49.49 117.58,60.96 118.64,60.96 119.41,60.2 119.41,52.73 | 120.7,39.32 v120.7,39.01 | 164.29,59.74 164.29,58.57 J2.A12 J2.B1 | 164.21,49.53 164.21,50.73 J2.A1 J2.B12
  Top 0.152: 152.36,53 153.75,51.61 153.76,51.61 154.46,50.91 154.46,49.53
  Bottom 0.152: v49.45,103.94 v49.45,107.44 | v35.89,51.97 v37.11,53.19 | v8,64.69 v6.55,64.69 | v10.44,101.04 v12.42,99.06 | v80.47,12.19 80.54,12.19 v82.83,14.48 85.19,14.48 85.27,14.4 v87.33,14.4 | v83.06,45.64 v85.34,47.93 85.34,47.85 85.95,47.24 90.75,47.24 v95.02,51.51 | v120.09,36.88 120.09,38.41 v120.7,39.01
  pour Bottom: 0.23,63.69 0.25,63.63 0.25,45.57 0.23,45.51 0.19,45.47 0.15,45.46 0.15,0.15 75.85,0.15 75.85,10.03 75.87,10.09 75.91,10.13 75.97,10.15 94.23,10.15 94.29,10.13 94.33,10.09 94.35,10.03 94.35,0.15 170.05,0.15 170.05,67.05 92.17,67.05 92.11,67.07 92.07,67.11 92.05,67.17 92.05,111.05 68.72,111.05 68.72,110.17 68.7,110.11 68.66,110.07 68.6,110.05 18.97,110.05 18.91,110.07 18.87,110.11 18.85,110.17 18.85,111.05 0.15,111.05 0.15,63.74 0.19,63.73
  pour Top: 0.23,63.69 0.25,63.63 0.25,45.57 0.23,45.51 0.19,45.47 0.15,45.46 0.15,0.15 75.85,0.15 75.85,10.03 75.87,10.09 75.91,10.13 75.97,10.15 94.23,10.15 94.29,10.13 94.33,10.09 94.35,10.03 94.35,0.15 170.05,0.15 170.05,67.05 92.17,67.05 92.11,67.07 92.07,67.11 92.05,67.17 92.05,111.05 68.72,111.05 68.72,110.17 68.7,110.11 68.66,110.07 68.6,110.05 18.97,110.05 18.91,110.07 18.87,110.11 18.85,110.17 18.85,111.05 0.15,111.05 0.15,63.74 0.19,63.73
GPIO8
  Top 0.152: R1.1 20.27,42.6 20.27,44.58 19.28,45.57 19.28,45.8 U2.10
INT_RTC  (via drill 0.35)
  Top 0.152: 86.26,46.94 54.56,46.94 TP15.TP 50.75,43.2 49.45,43.2 40.39,52.27 v40.39,53.26 | 86.26,46.94 86.94,46.94 R1_PINH1.1 | v18.97,44.58 18.36,43.97 17.75,43.97 16.76,44.96 16.76,45.8 U2.8 | v86.26,55.32 88.24,57.3 88.24,59.21 U3.3 | 86.26,46.94 v86.26,47.85
  Bottom 0.152: v18.97,44.58 18.97,47.7 29.34,58.06 35.59,58.06 v40.39,53.26 | v86.26,47.85 v86.26,55.32
IO/BOOT  (via drill 0.35)
  Top 0.152: 45.72,108.74 52.81,108.74 C6.1 52.2,109.4 BOOT_BUTTON.3 | v24.38,70.41 24.38,63.4 U2.15 | v41.76,107.75 42.22,107.75 43.2,108.74 45.72,108.74 | 45.72,108.74 R_BOOT.1 46.37,109.4 BOOT_BUTTON.4
  Bottom 0.152: v24.38,70.41 41.76,87.78 v41.76,107.75
IO/CHANGE  (via drill 0.35)
  Top 0.152: R_CHANGE.1 60.27,107.52 61.49,108.74 67.06,108.74 C10.1 66.47,109.4 CHANGE_BUTTON.3 | v16.76,66.22 14.25,63.7 14.25,63.4 U2.23 | v59.36,106.6 R_CHANGE.1 | v58.5,107.44 v58.51,107.45 R_CHANGE.1 | v58.5,108.81 59.09,109.4 CHANGE_BUTTON.4
  Bottom 0.152: v16.76,66.22 22.48,66.22 59.36,103.1 v59.36,106.6 | v58.5,107.44 v58.5,108.81
MISO  (via drill 0.35)
  Top 0.152: v39.09,29.18 38.48,28.57 38.1,28.57 R8.1 | v39.17,35.2 38.1,36.27 D12.2 TP6.TP | v33.15,55.47 34.14,56.46 U1.2 | v27.58,54.94 17.22,54.94 9.14,63.02 9.14,63.32 U2.27 9.07,63.4 v9.07,64.69 | v7.24,92.43 6.02,93.65 5.87,93.65 J4.P7
  Bottom 0.152: v39.09,29.18 39.09,35.13 v39.17,35.2 39.09,35.2 33.15,41.15 33.15,54.94 | 33.15,54.94 v33.15,55.47 | 33.15,54.94 v27.58,54.94 | v7.24,92.43 7.24,90.37 9.07,88.54 v9.07,64.69
MOSI  (via drill 0.35)
  Top 0.152: v80.47,14.48 81.15,13.79 83.13,13.79 84.28,14.94 84.28,15.39 J1.14 | v45.26,27.74 44.5,28.5 R7.1 44.42,28.5 42.9,26.98 30.79,26.98 TP7.TP | v45.26,50.75 42.06,53.95 U1.5 | v45.49,36.35 44.5,36.35 D11.2 | v19.05,41.99 15.47,45.57 15.47,45.8 U2.7 | v4.27,80.92 4.27,88.54 4.95,89.23 5.79,89.23 J4.P3
  Bottom 0.152: v80.47,14.48 80.16,14.48 66.9,27.74 v45.26,27.74 45.26,28.57 | 45.26,28.57 45.26,36.35 | 45.26,36.35 v45.26,50.75 | 45.26,36.35 v45.49,36.35 | 45.26,28.57 36.27,28.57 22.86,41.99 v19.05,41.99 17.45,43.59 17.45,45.64 4.27,58.83 v4.27,80.92
N$1  (via drill 0.35)
  Top 0.152: v118.72,36.88 118.72,35.59 C1_BAT1.1 | v118.34,38.25 119.33,38.25 D2.1 119.41,38.33 119.48,38.41 121.77,38.41 IC4.3 121.84,38.48 122,38.48 122.53,39.01 122.53,39.78 122,40.31 121.84,40.31 IC4.1 | v133.12,44.96 133.04,45.03 133.04,45.95 Q1.2
  Bottom 0.152: v118.72,36.88 118.72,37.87 118.68,37.91 | v118.34,38.25 118.68,37.91 | v133.12,44.96 125.73,44.96 118.68,37.91
N$2
  Top 0.152: J1.24 79.32,15.47 79.32,18.44 77.5,20.27 77.5,20.88 EPD_C12.1
N$3
  Top 0.152: R2-USB1.2 146.07,51.51 147.98,51.51 151.1,54.63 155.45,54.63 155.68,54.41 155.68,53.57 155.45,53.34 154.46,53.34 154.23,53.11 154.23,52.27 154.46,52.05 161.77,52.05 163.07,53.34 163.68,53.34 J2.A5
N$4  (via drill 0.35)
  Top 0.152: C4.1 93.95,32.38 92.58,32.38 91.97,31.77 D4.1 91.9,31.77 91.44,32.23 v90.75,32.23 | v81.92,35.59 79.55,35.59 D3.2
  Bottom 0.152: v81.92,35.59 87.4,35.59 v90.75,32.23
N$5  (via drill 0.35)
  Top 0.152: v118.95,52.05 119.86,52.05 CHG_LED.C | v120.02,50.52 120.02,49.53 R1_BAT.1
  Bottom 0.152: v118.95,52.05 118.95,51.59 v120.02,50.52
N$6  (via drill 0.35)
  Top 0.152: v123.29,49.53 R1_BAT.2 | v127.56,49 127.56,49.38 127.1,49.84 MCP73831.1
  Bottom 0.152: v123.29,49.53 127.03,49.53 v127.56,49
N$7
  Top 0.152: R2_BAT.2 124.44,47.7 124.44,49.84 MCP73831.5
N$8
  Top 0.152: R2-USB.1 154.99,52.73 159.49,52.73 163.07,56.31 163.68,56.31 J2.B5
N$9
  Top 0.152: IC1.5 50.98,102.49 51.82,102.49 53.34,100.97 C_DELAY.1
N$10  (via drill 0.35)
  Top 0.152: v88.7,14.48 88.77,14.55 88.77,15.39 J1.5 | v88.54,17.07 84.28,17.07 81.31,20.04 v81.31,20.65 | v76.81,18.75 75.82,18.75 75.44,18.36 74.3,18.36 73.69,17.75 EPD_C2.1
  Bottom 0.152: v88.7,14.48 88.7,16.92 v88.54,17.07 | v81.31,20.65 78.72,20.65 v76.81,18.75
N$11
  Top 0.152: D7.1 87.86,62.64 88.24,62.26 R_CAPACITOR.1
N$12  (via drill 0.35)
  Top 0.152: v80.39,18.21 80.39,15.47 J1.22 | v82.22,20.04 82.22,20.57 82.53,20.88 EPD_C10.1
  Bottom 0.152: v82.22,20.04 v80.39,18.21
N$13  (via drill 0.35)
  Top 0.152: v80.47,13.11 81.08,12.5 88.54,12.5 89.31,13.26 89.31,15.39 J1.4 | v75.97,17.6 75.06,17.6 74.98,17.68 EPD_C1.1
  Bottom 0.152: v75.97,17.6 v80.47,13.11
N$14  (via drill 0.35)
  Top 0.152: v81.38,16.54 81.38,15.47 J1.20 | v85.04,20.04 86.56,20.04 87.4,20.88 87.63,20.88 EPD_C8.1
  Bottom 0.152: v81.38,16.54 81.53,16.54 v85.04,20.04
N$15
  Top 0.152: SENSOR2.8 155.07,9.98 155.07,11.05 155.75,11.73 155.75,12.88 SENSOR2.2
N$17  (via drill 0.35)
  Top 0.152: v81.92,14.48 81.92,15.39 J1.19 | v87.33,19.89 89.15,19.89 90.14,20.88 EPD_C7.1
  Bottom 0.152: v87.33,19.89 v81.92,14.48
N$18  (via drill 0.35)
  Top 0.152: v82.3,16.38 82.3,15.47 J1.18 | v85.04,19.13 90.91,19.13 92.66,20.88 EPD_C6.1
  Bottom 0.152: v85.04,19.13 v82.3,16.38
PREVGH  (via drill 0.35)
  Top 0.152: v81.23,17.45 80.77,16.99 80.77,15.47 J1.21 | 84.28,20.34 84.43,20.34 85.04,20.95 EPD_C9.1 | 84.28,20.34 83.06,21.57 79.55,21.57 79.32,21.79 79.32,22.71 79.48,22.86 81.31,22.86 86.33,27.89 88.39,27.89 D5.1 | 84.28,20.34 v84.12,20.34
  Bottom 0.152: v84.12,20.34 v81.23,17.45
PREVGL  (via drill 0.35)
  Top 0.152: v79.78,18.9 79.78,15.47 J1.23 | v80.62,20.04 80.62,20.27 80.01,20.88 EPD_C11.1 80.01,20.95 79.7,20.95 79.02,21.64 79.02,22.86 79.32,23.16 81.15,23.16 88.39,30.4 88.39,31.7 D4.2
  Bottom 0.152: v79.78,18.9 79.78,19.2 v80.62,20.04
RESE  (via drill 0.35)
  Top 0.152: v90.37,16.38 89.92,15.93 89.92,15.47 J1.3 | v88.62,21.11 88.16,21.57 v83.97,21.57 | v76.96,19.81 76.96,19.51 77.42,19.05 77.42,18.14 74.52,15.24 R3.2 74.3,15.24 72.85,16.69 70.56,16.69 Q3.2
  Bottom 0.152: v90.37,16.38 90.37,19.36 v88.62,21.11 | v83.97,21.57 78.72,21.57 v76.96,19.81
RESE'
  Top 0.152: SJ1.2 69.95,12.04 71.09,12.04 R2.2 71.17,12.12 73,13.95 R3.1
RESET  (via drill 0.35)
  Top 0.152: v20.95,106.53 20.27,107.21 20.27,107.44 R_RESET.1 19.45,107.45 v19,107 | v28.88,108.13 28.57,108.13 27.96,108.74 C5.1 27.29,109.4 RESET_BUTTON.3 | v46.41,104.24 48.08,102.56 IC1.1 | v10.44,59.51 10.44,45.87 U2.3 | v18.5,109 18.9,109.4 RESET_BUTTON.4
  Bottom 0.152: v46.41,104.24 46.18,104.24 42.06,108.36 29.11,108.36 v28.88,108.13 27.28,106.53 v20.95,106.53 10.44,96.01 v10.44,59.51 | v19,107 18.5,107.5 v18.5,109
RTC_RST  (via drill 0.35)
  Top 0.152: v25.3,60.88 23.09,63.09 23.09,63.32 U2.16 | v85.72,60.88 86.94,59.66 86.94,59.28 U3.4
  Bottom 0.152: v85.72,60.88 v25.3,60.88
RX
  Top 0.152: U2.24 12.95,63.4 12.95,66.9 18.44,72.39 TP2.TP
SCK  (via drill 0.35)
  Top 0.152: v49.84,29.18 50.44,28.57 50.75,28.57 R6.1 | v49.76,35.43 49.91,35.43 50.75,36.27 D10.2 | v84.05,13.41 84.05,13.95 84.81,14.71 84.81,15.39 J1.13 | v75.29,49.53 TP8.TP 49.38,49.53 | 41.22,54.03 41.22,53.72 45.41,49.53 49.38,49.53 | 41.22,54.03 41.22,54.25 41.99,55.02 41.99,55.24 U1.6 | 15.13,47.05 17.91,49.84 v34.67,49.84 | 15.13,47.05 14.25,46.18 14.25,45.87 U2.6 | 41.22,54.03 v40.92,54.03 | v3.58,90.14 4.88,91.44 5.79,91.44 J4.P5 | 15.13,47.05 v15.01,47.17 | 49.38,49.53 v49.38,48.92
  Bottom 0.152: v49.84,29.18 49.84,33.38 49.76,33.45 v49.76,35.43 49.76,48.54 v49.38,48.92 | v84.05,13.41 84.43,13.41 84.89,12.95 89,12.95 91.67,15.62 91.67,32.69 75.29,49.07 v75.29,49.53 | v34.67,49.84 37.87,49.84 41,52.96 41,53.95 v40.92,54.03 | v3.58,90.14 1.45,88.01 1.45,60.73 v15.01,47.17
SCL  (via drill 0.35)
  Top 0.152: 156.71,13.91 157.35,13.26 157.35,12.95 SENSOR2.4 | 156.71,13.91 156.67,13.95 154.46,13.95 152.63,12.12 152.63,5.56 153.09,5.11 154.23,5.11 154.76,5.64 154.91,5.64 R2-PINH.1 | v141.81,50.29 138.53,53.57 138.15,53.57 U4.7 | v164.44,27.66 164.44,20.8 J3.4 | v156.74,18.14 156.74,13.95 156.71,13.91 | v22.71,58.37 18.06,63.02 18.06,63.32 U2.20 | v90.75,51.74 90.75,49.99 U3.16
  Bottom 0.152: v156.74,18.14 156.74,20.04 164.36,27.66 v164.44,27.66 v141.81,50.29 120.7,50.29 120.32,49.91 97.54,49.91 95.33,52.12 91.06,52.12 90.75,51.82 v90.75,51.74 84.12,58.37 v22.71,58.37
SDA  (via drill 0.35)
  Top 0.152: 154.04,12.99 154.69,13.64 156.13,13.64 156.59,13.18 156.59,12.95 SENSOR2.3 | 154.04,12.99 152.93,11.89 152.93,6.55 153.62,5.87 153.62,5.71 R1_PINH.1 | v139.06,54.03 138.15,54.03 U4.8 | v163.6,29.49 163.6,20.34 164.13,19.81 164.44,19.81 J3.3 | v154.23,12.8 154.04,12.99 | v23.39,58.98 19.28,63.09 19.28,63.32 U2.19 | v90.14,53.26 90.14,50.6 89.53,49.99 U3.15
  Bottom 0.152: v154.23,12.8 154.23,14.71 165.05,25.53 165.05,28.04 v163.6,29.49 v139.06,54.03 139.06,53.95 90.75,53.95 90.14,53.34 v90.14,53.26 84.43,58.98 v23.39,58.98
SRC  (via drill 0.35)
  Top 0.152: C4.2 93.95,31.09 93.95,29.95 91.97,27.96 D5.2 91.9,27.96 v89.53,27.96 | v71.09,25.45 69.88,24.23 69.88,18.9 Q3.3 | v77.33,32.69 81.15,32.69 81.23,32.77 L1.1
  Bottom 0.152: v71.09,25.45 71.09,26.45 v77.33,32.69 78.26,32.69 82.98,27.96 v89.53,27.96
SS_SD  (via drill 0.35)
  Top 0.152: 11.43,88.24 R10.1 | 15.51,84.16 15.54,84.12 16.92,84.12 17.37,84.58 17.37,97.69 16,99.06 D8.2 | 15.51,84.16 11.43,88.24 | v11.66,58.29 11.66,45.87 U2.4 | 15.51,84.16 v11.66,80.31 | v4.88,88.24 6.17,88.24 J4.P2 | 11.43,88.24 v8.46,88.24
  Bottom 0.152: v11.66,80.31 v11.66,58.29 | v8.46,88.24 v4.88,88.24
TX
  Top 0.152: U2.25 11.66,63.4 11.66,70.64 13.41,72.39 TP1.TP
USB_D+  (via drill 0.35)
  Top 0.152: v148.74,51.36 149.12,51.74 149.81,51.74 D1.1 | v17.45,48.46 22.02,48.46 24.31,46.18 24.31,45.87 U2.14
  Bottom 0.152: v148.74,51.36 142.65,51.36 132.51,61.49 73.91,61.49 73.84,61.42 25.68,61.42 25.6,61.49 24.46,61.49 17.45,54.48 v17.45,48.46
USB_D-  (via drill 0.35)
  Top 0.152: v148.74,49.61 148.97,49.84 149.81,49.84 D1.3 | v17.45,47.55 21.72,47.55 23.01,46.25 23.01,45.87 U2.13
  Bottom 0.152: v148.74,49.61 148.74,50.44 149.35,51.05 149.35,51.66 138.38,62.64 17.83,62.64 16.84,61.65 16.84,48.16 v17.45,47.55
VBAT
  Top 0.152: U4.2 136.25,53.57 136.25,53.11 U4.3 136.17,53.03 133.58,53.03 132.02,51.47 | 132.02,51.47 130.84,52.65 C2_BAT.1 130.76,52.65 129.92,51.82 127.1,51.82 MCP73831.3 127.1,51.89 123.22,55.78 123.22,59.66 TP3.TP | 132.02,51.47 132.06,51.44 132.06,48.16 Q1.3
VBUS
  Top 0.3: D1.5 152.32,50.75 151.94,50.75 150.8,49.61 150.8,47.32 150.57,47.09 C4_USB.1 150.5,46.94 150.5,45.72 C5_USB.1 150.42,45.64 150.42,44.65 147.68,41.91 PFMF.050.1.2 147.52,41.99 135.1,41.99 131.22,45.87 Q1.1 131.06,46.02 129.54,46.02 125.35,50.22 125.35,50.83 124.51,51.66 MCP73831.4 124.36,51.82 124.13,52.05 121.46,52.05 CHG_LED.A 121.31,51.97 120.62,51.28 119.33,51.28 | R1_PWRUSB.2 116.89,40.08 119.02,40.08 119.33,40.39 D2.2 119.33,40.54 119.33,51.28 | 119.33,51.28 116.97,51.28 116.2,52.05 C1_BAT.1 116.28,52.2 118.11,54.03 TP14.TP
VRTC  (via drill 0.35)
  Top 0.152: C10_SUPERCAP.2 97.77,49.76 97.38,50.14 94.03,50.14 C8.1 93.95,50.22 93.27,50.9 93.27,50.98 | 93.27,50.98 93.27,51.89 94.72,53.34 94.72,62.03 91.29,65.46 89.46,65.46 89.31,65.3 89.31,64.24 89.53,64.01 89.53,62.26 R_CAPACITOR.2 | v88.32,51.51 88.32,49.99 U3.14 | 93.27,50.98 v92.96,50.98
  Bottom 0.152: v88.32,51.51 90.07,51.51 90.6,50.98 v92.96,50.98
VUSB
  Top 0.3: J2.A9 J2.B4 165.14,56.86 166,56 166,53 165.36,52.36 | J2.A4 J2.B9 165,52.36 165.36,52.36 | PFMF.050.1.1 161.91,41.91 166.25,46.24 166.25,52 165.88,52.36 165.36,52.36
(copper drawn outside any net)
  shapes: Top area x9